# Altium schematic sheet CAN.SchDoc
size A4; DocumentNumber: 14; SheetNumber: 14; SheetTotal: 15
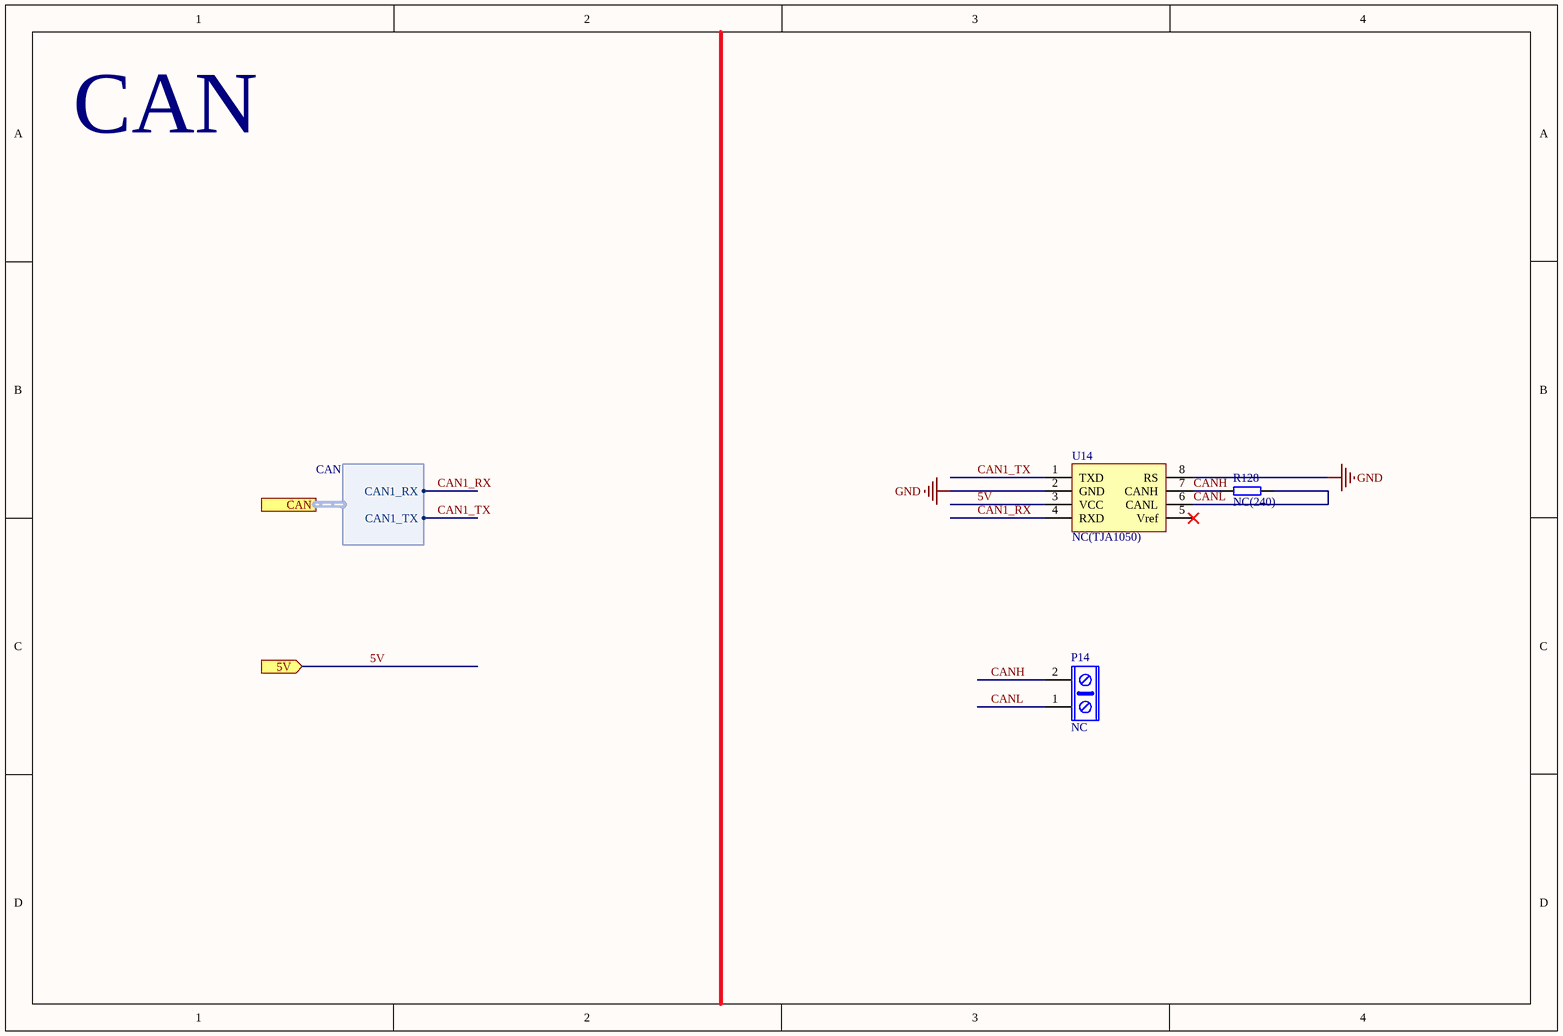
[diagram p0: CAN.SchDoc]

## Parts
P14  NC  [PORT2-5.08MM]
R128  NC(240)  [0402]
U14  NC(TJA1050)  [SOP8]

## Ports
5V (in), CAN (harness CAN)

## Harnesses
CAN: CAN1_TX, CAN1_RX

## Nets
GND: U14.2(GND) U14.8(RS)
5V: U14.3(VCC) ; port 5V
CAN1_RX: U14.4(RXD) ; port CAN.CAN1_RX
CAN1_TX: U14.1(TXD) ; port CAN.CAN1_TX
CANH: P14.2 R128.1 U14.7(CANH)
CANL: P14.1 R128.2 U14.6(CANL)

Not connected (* = marked no-connect by the designer): U14 5(Vref)*

## Notes on the sheet
- CAN

## Library data of the parts
P14 = 接线端子: 接线端子 2脚
R128 = RES
U14 = TJA1050: High speed CAN transceiver